# EAGLE schematic 006 (EAGLE 9.6.2)

## Sheet 1 of 2
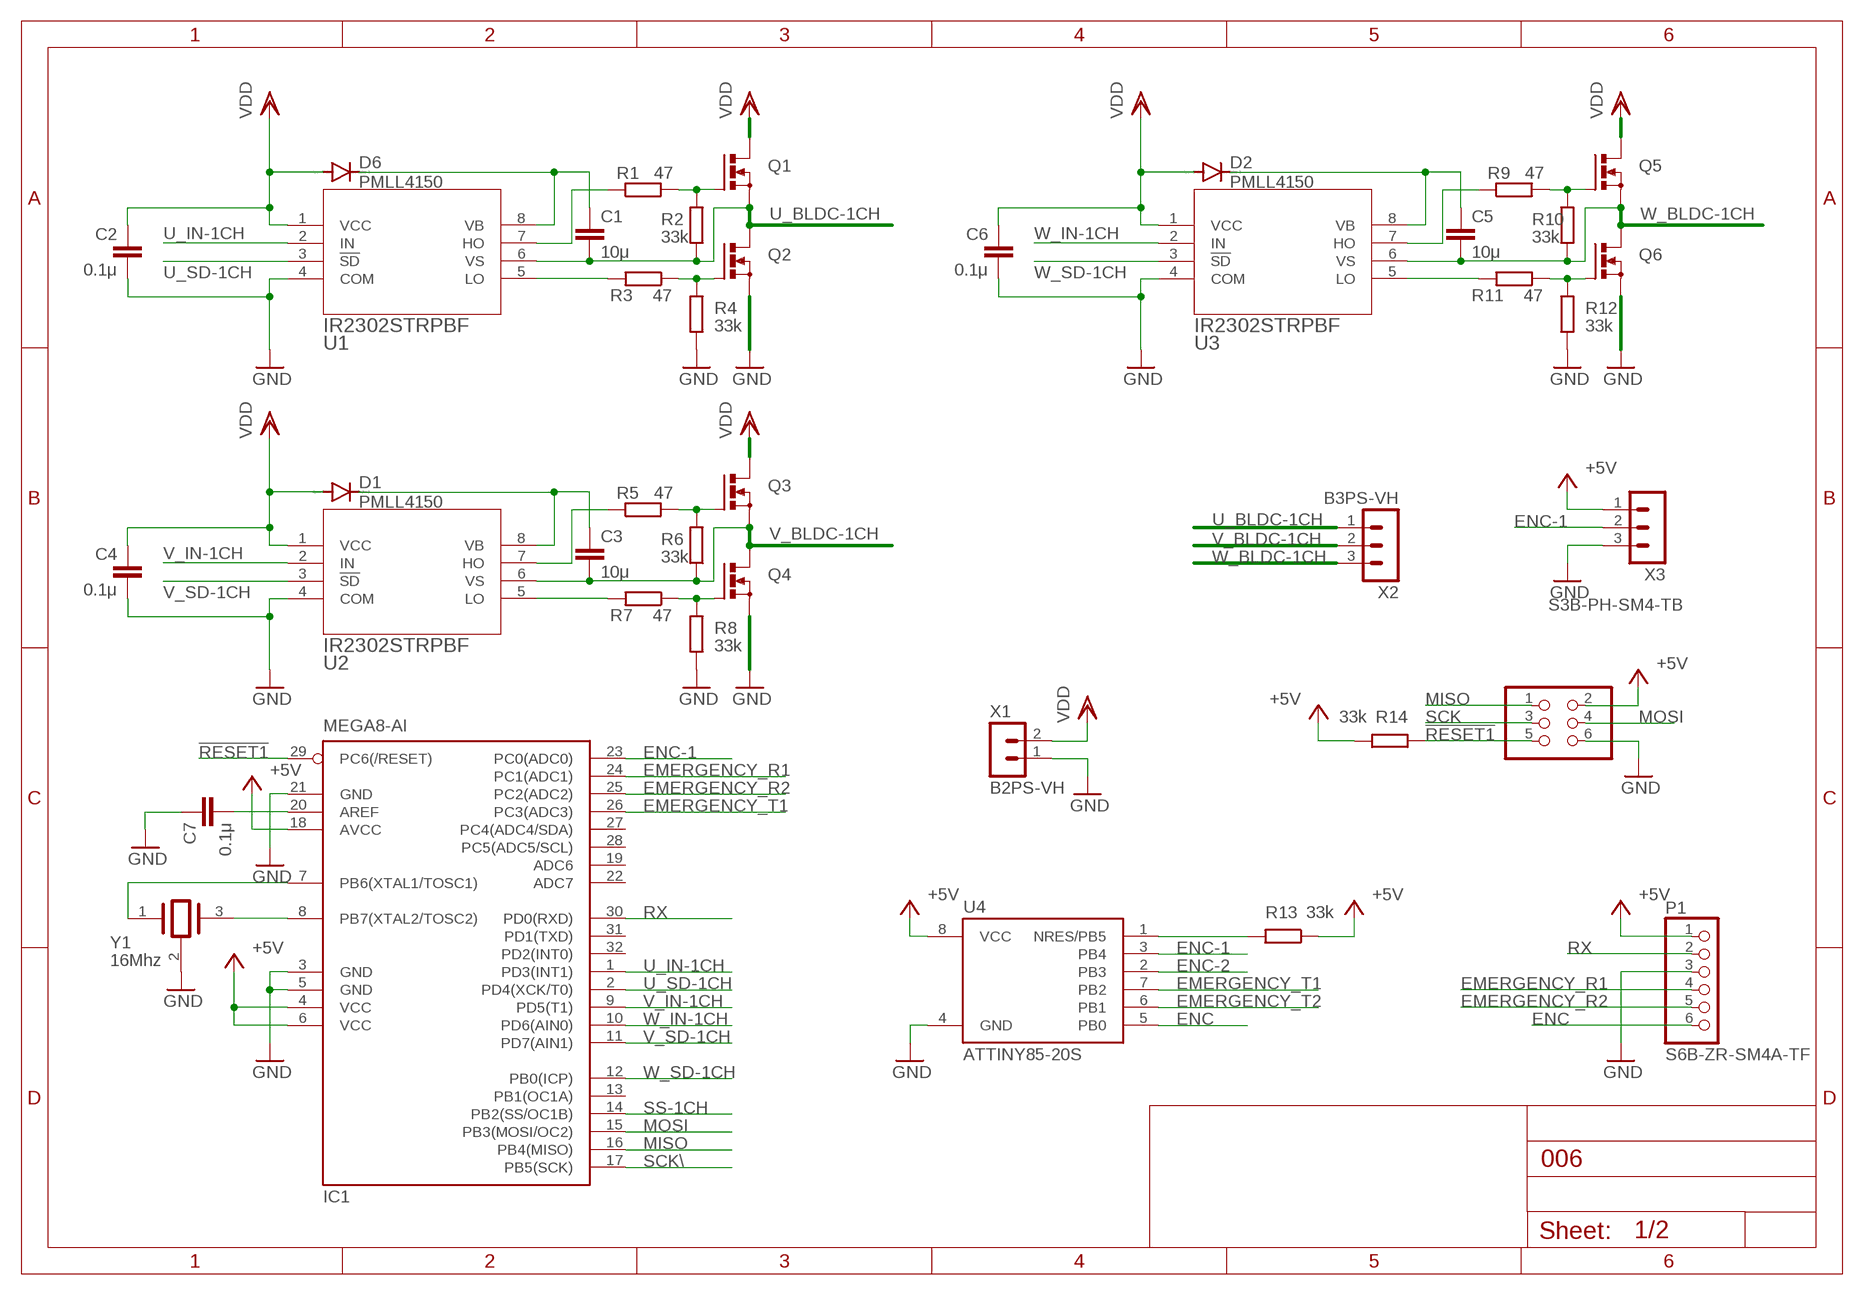
[diagram p0: schematic, sheet 1]

### Parts
C1  10μ  C-EUC1608  [C1608]
C2  0.1μ  C-EUC1608  [C1608]
C3  10μ  C-EUC1608  [C1608]
C4  0.1μ  C-EUC1608  [C1608]
C5  10μ  C-EUC1608  [C1608]
C6  0.1μ  C-EUC1608  [C1608]
C7  0.1μ  C-EUC1608  [C1608]
D1  PMLL4150  [SOD80C]
D2  PMLL4150  [SOD80C]
D6  PMLL4150  [SOD80C]
IC1  MEGA8-AI  [TQFP32-08]
JP1  PINHD-2X3  [2X03]
P1  S6B-ZR-SM4A-TF  [ZH-SM4-SIDE06]
Q1  N-MOSFET-SO8S  [SO-08]
Q2  N-MOSFET-SO8S  [SO-08]
Q3  N-MOSFET-SO8S  [SO-08]
Q4  N-MOSFET-SO8S  [SO-08]
Q5  N-MOSFET-SO8S  [SO-08]
Q6  N-MOSFET-SO8S  [SO-08]
R1  47  R-EU_R0603  [R0603]
R2  33k  R-EU_R0603  [R0603]
R3  47  R-EU_R0603  [R0603]
R4  33k  R-EU_R0603  [R0603]
R5  47  R-EU_R0603  [R0603]
R6  33k  R-EU_R0603  [R0603]
R7  47  R-EU_R0603  [R0603]
R8  33k  R-EU_R0603  [R0603]
R9  47  R-EU_R0603  [R0603]
R10  33k  R-EU_R0603  [R0603]
R11  47  R-EU_R0603  [R0603]
R12  33k  R-EU_R0603  [R0603]
R13  33k  R-EU_R0603  [R0603]
R14  33k  R-EU_R0603  [R0603]
U1  IR2302STRPBF  [PG-DSO-8-910_INF]
U2  IR2302STRPBF  [PG-DSO-8-910_INF]
U3  IR2302STRPBF  [PG-DSO-8-910_INF]
U4  ATTINY85-20S  [SOIC8_EIAJ_208MIL]
X1  B2PS-VH  [B2PS-VH]
X2  B3PS-VH  [B3PS-VH]
X3  S3B-PH-SM4-TB  [S3B-PH-SM4-TB]
Y1  16Mhz  MURATA_CSTNE16M0V53C000R0MURATA_CSTNE16M0V53C000R0_0_0  [MURATA_CSTNE16M0V53C000R0_0]

### Nets
!RESET1: IC1.29(PC6(/RESET)) JP1.5 R14.2
+5V: IC1.4(VCC) IC1.6(VCC) IC1.18(AVCC) JP1.2 P1.1 R13.1 R14.1 U4.8(VCC) X3.1 ; also sheet 2
EMERGENCY_R1: IC1.24(PC1(ADC1)) P1.4 ; also sheet 2
EMERGENCY_R2: IC1.25(PC2(ADC2)) P1.5 ; also sheet 2
EMERGENCY_T1: IC1.26(PC3(ADC3)) U4.7(PB2)
EMERGENCY_T2: U4.6(PB1) ; also sheet 2
ENC: P1.6 U4.5(PB0)
ENC-1: IC1.23(PC0(ADC0)) U4.3(PB4) X3.2
ENC-2: U4.2(PB3) ; also sheet 2
GND: C2.1 C4.1 C6.1 C7.2 IC1.3(GND) IC1.5(GND) IC1.21(GND) JP1.6 P1.3 Q2.1(S) Q2.2(S) Q2.3(S) Q4.1(S) Q4.2(S) Q4.3(S) Q6.1(S) Q6.2(S) Q6.3(S) R4.1 R8.1 R12.1 U1.4(COM) U2.4(COM) U3.4(COM) U4.4(GND) X1.1 X3.3 Y1.2(GND) ; also sheet 2
MISO: IC1.16(PB4(MISO)) JP1.1 ; also sheet 2
MOSI: IC1.15(PB3(MOSI/OC2)) JP1.4 ; also sheet 2
N$1: C3.1 D1.C U2.8(VB)
N$2: C1.1 D6.C U1.8(VB)
N$3: R1.1 U1.7(HO)
N$4: R5.1 U2.7(HO)
N$5: Q1.4(G) R1.2 R2.2
N$6: Q2.4(G) R3.1 R4.2
N$7: R3.2 U1.5(LO)
N$8: Q3.4(G) R5.2 R6.2
N$9: Q4.4(G) R7.1 R8.2
N$10: R7.2 U2.5(LO)
N$11: C5.1 D2.C U3.8(VB)
N$12: R9.1 U3.7(HO)
N$13: Q5.4(G) R9.2 R10.2
N$14: Q6.4(G) R11.1 R12.2
N$15: R11.2 U3.5(LO)
N$16: R13.2 U4.1(NRES/PB5)
N$20: IC1.8(PB7(XTAL2/TOSC2)) Y1.3(OUTPUT)
N$21: IC1.7(PB6(XTAL1/TOSC1)) Y1.1(INPUT)
N$23: C7.1 IC1.20(AREF)
RX: IC1.30(PD0(RXD)) P1.2 ; also sheet 2
SCK: JP1.3 ; also sheet 2
SCK\: IC1.17(PB5(SCK)) ; also sheet 2
SS-1CH: IC1.14(PB2(SS/OC1B))
U_BLDC-1CH: C1.2 Q1.1(S) Q1.2(S) Q1.3(S) Q2.5(D) Q2.6(D) Q2.7(D) Q2.8(D) R2.1 U1.6(VS) X2.1
U_IN-1CH: IC1.1(PD3(INT1)) U1.2(IN)
U_SD-1CH: IC1.2(PD4(XCK/T0)) U1.3(!SD)
V_BLDC-1CH: C3.2 Q3.1(S) Q3.2(S) Q3.3(S) Q4.5(D) Q4.6(D) Q4.7(D) Q4.8(D) R6.1 U2.6(VS) X2.2
V_IN-1CH: IC1.9(PD5(T1)) U2.2(IN)
V_SD-1CH: IC1.11(PD7(AIN1)) U2.3(!SD)
VDD: C2.2 C4.2 C6.2 D1.A D2.A D6.A Q1.5(D) Q1.6(D) Q1.7(D) Q1.8(D) Q3.5(D) Q3.6(D) Q3.7(D) Q3.8(D) Q5.5(D) Q5.6(D) Q5.7(D) Q5.8(D) U1.1(VCC) U2.1(VCC) U3.1(VCC) X1.2 ; also sheet 2
W_BLDC-1CH: C5.2 Q5.1(S) Q5.2(S) Q5.3(S) Q6.5(D) Q6.6(D) Q6.7(D) Q6.8(D) R10.1 U3.6(VS) X2.3
W_IN-1CH: IC1.10(PD6(AIN0)) U3.2(IN)
W_SD-1CH: IC1.12(PB0(ICP)) U3.3(!SD)
Unconnected: IC1.13(PB1(OC1A)) IC1.19(ADC6) IC1.22(ADC7) IC1.27(PC4(ADC4/SDA)) IC1.28(PC5(ADC5/SCL)) IC1.31(PD1(TXD)) IC1.32(PD2(INT0))

## Sheet 2 of 2
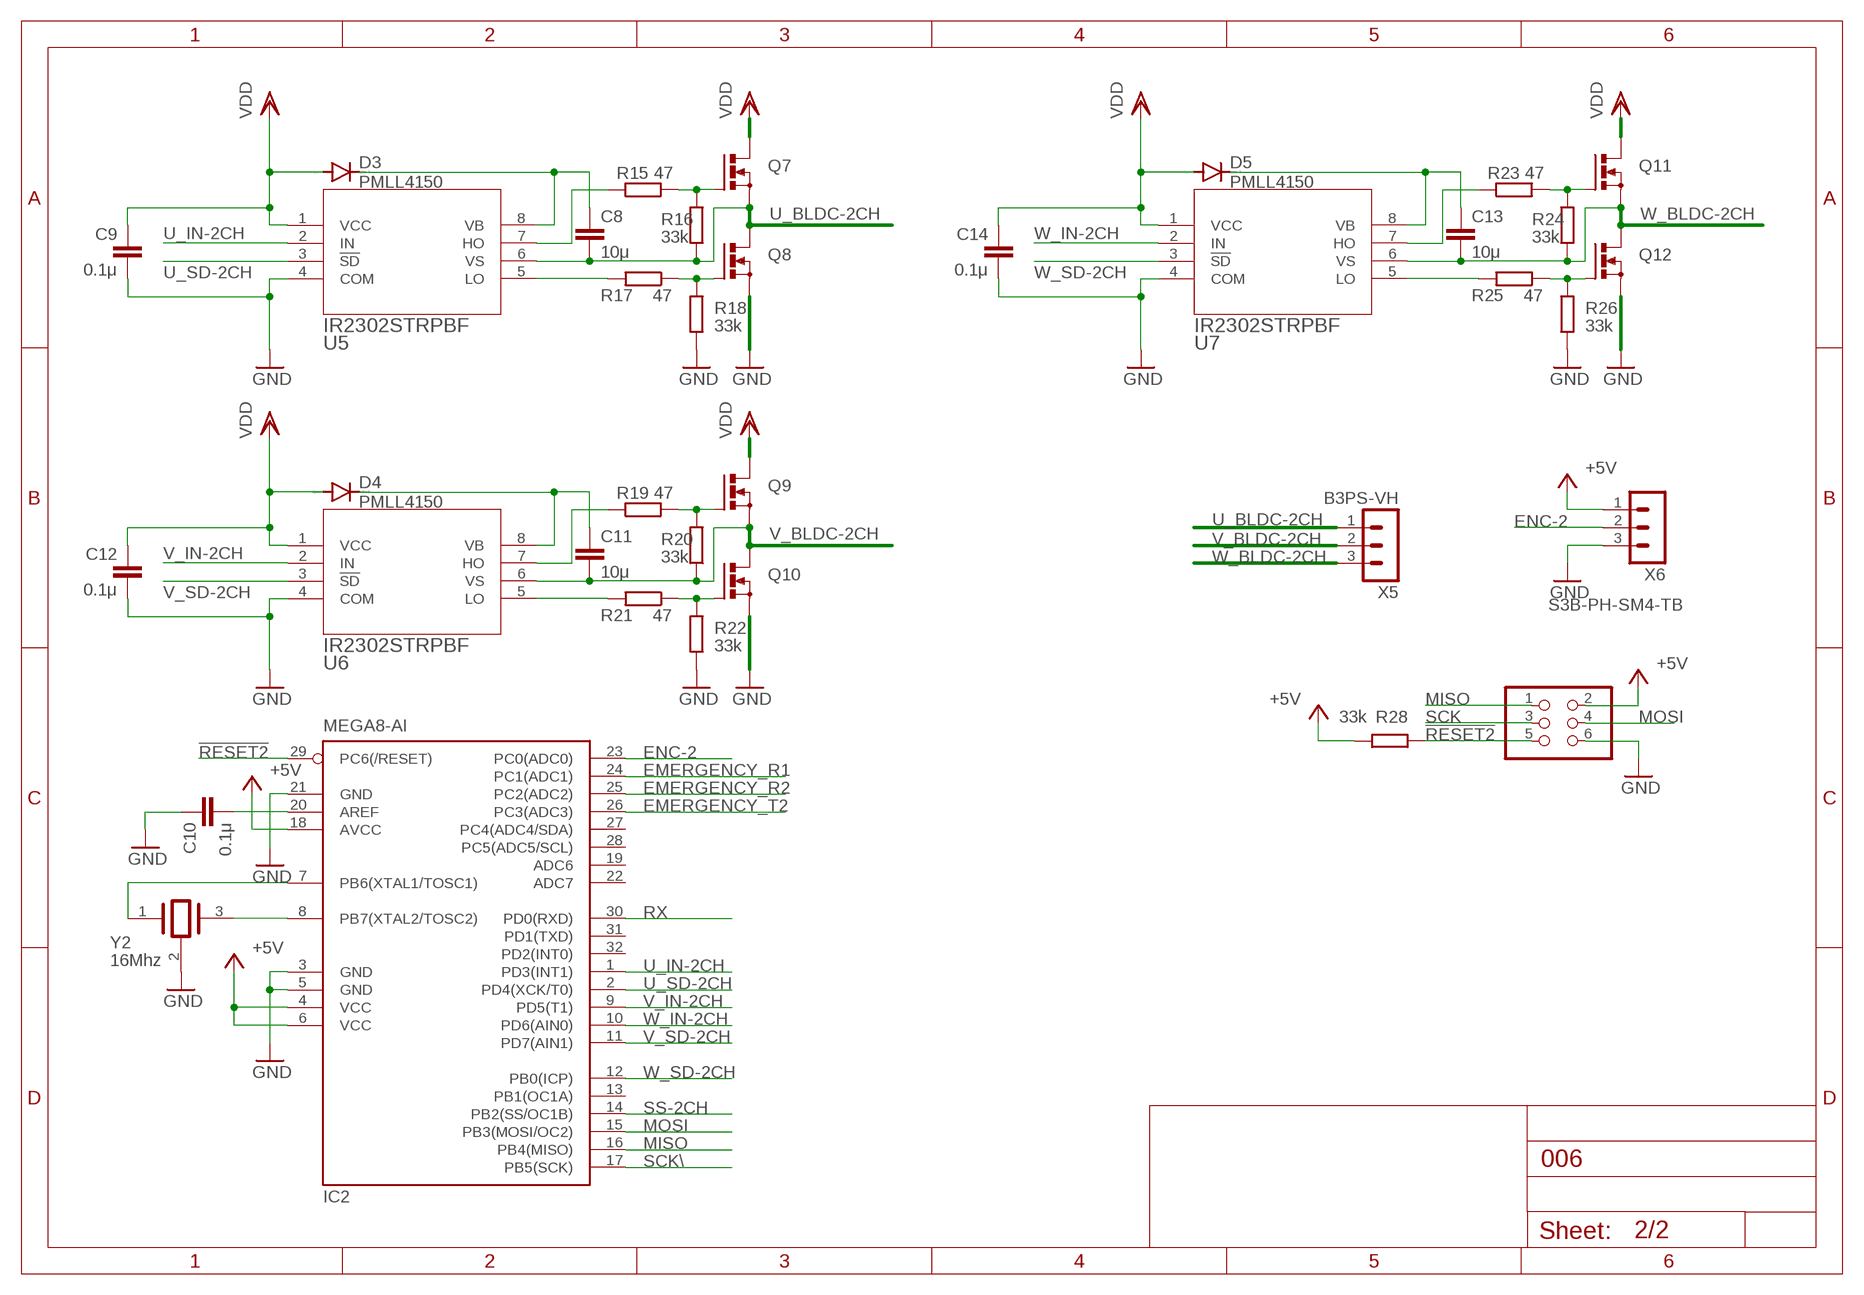
[diagram p1: schematic, sheet 2]

### Parts
C8  10μ  C-EUC1608  [C1608]
C9  0.1μ  C-EUC1608  [C1608]
C10  0.1μ  C-EUC1608  [C1608]
C11  10μ  C-EUC1608  [C1608]
C12  0.1μ  C-EUC1608  [C1608]
C13  10μ  C-EUC1608  [C1608]
C14  0.1μ  C-EUC1608  [C1608]
D3  PMLL4150  [SOD80C]
D4  PMLL4150  [SOD80C]
D5  PMLL4150  [SOD80C]
IC2  MEGA8-AI  [TQFP32-08]
JP2  PINHD-2X3  [2X03]
Q7  N-MOSFET-SO8S  [SO-08]
Q8  N-MOSFET-SO8S  [SO-08]
Q9  N-MOSFET-SO8S  [SO-08]
Q10  N-MOSFET-SO8S  [SO-08]
Q11  N-MOSFET-SO8S  [SO-08]
Q12  N-MOSFET-SO8S  [SO-08]
R15  47  R-EU_R0603  [R0603]
R16  33k  R-EU_R0603  [R0603]
R17  47  R-EU_R0603  [R0603]
R18  33k  R-EU_R0603  [R0603]
R19  47  R-EU_R0603  [R0603]
R20  33k  R-EU_R0603  [R0603]
R21  47  R-EU_R0603  [R0603]
R22  33k  R-EU_R0603  [R0603]
R23  47  R-EU_R0603  [R0603]
R24  33k  R-EU_R0603  [R0603]
R25  47  R-EU_R0603  [R0603]
R26  33k  R-EU_R0603  [R0603]
R28  33k  R-EU_R0603  [R0603]
U5  IR2302STRPBF  [PG-DSO-8-910_INF]
U6  IR2302STRPBF  [PG-DSO-8-910_INF]
U7  IR2302STRPBF  [PG-DSO-8-910_INF]
X5  B3PS-VH  [B3PS-VH]
X6  S3B-PH-SM4-TB  [S3B-PH-SM4-TB]
Y2  16Mhz  MURATA_CSTNE16M0V53C000R0MURATA_CSTNE16M0V53C000R0_0_0  [MURATA_CSTNE16M0V53C000R0_0]

### Nets
!RESET2: IC2.29(PC6(/RESET)) JP2.5 R28.2
+5V: IC2.4(VCC) IC2.6(VCC) IC2.18(AVCC) JP2.2 R28.1 X6.1 ; also sheet 1
EMERGENCY_R1: IC2.24(PC1(ADC1)) ; also sheet 1
EMERGENCY_R2: IC2.25(PC2(ADC2)) ; also sheet 1
EMERGENCY_T2: IC2.26(PC3(ADC3)) ; also sheet 1
ENC-2: IC2.23(PC0(ADC0)) X6.2 ; also sheet 1
GND: C9.1 C10.2 C12.1 C14.1 IC2.3(GND) IC2.5(GND) IC2.21(GND) JP2.6 Q8.1(S) Q8.2(S) Q8.3(S) Q10.1(S) Q10.2(S) Q10.3(S) Q12.1(S) Q12.2(S) Q12.3(S) R18.1 R22.1 R26.1 U5.4(COM) U6.4(COM) U7.4(COM) X6.3 Y2.2(GND) ; also sheet 1
MISO: IC2.16(PB4(MISO)) JP2.1 ; also sheet 1
MOSI: IC2.15(PB3(MOSI/OC2)) JP2.4 ; also sheet 1
N$17: C8.1 D3.C U5.8(VB)
N$18: R15.1 U5.7(HO)
N$19: Q7.4(G) R15.2 R16.2
N$22: Q8.4(G) R17.1 R18.2
N$24: R17.2 U5.5(LO)
N$25: IC2.8(PB7(XTAL2/TOSC2)) Y2.3(OUTPUT)
N$26: IC2.7(PB6(XTAL1/TOSC1)) Y2.1(INPUT)
N$27: C10.1 IC2.20(AREF)
N$28: C11.1 D4.C U6.8(VB)
N$29: R19.1 U6.7(HO)
N$30: Q9.4(G) R19.2 R20.2
N$31: Q10.4(G) R21.1 R22.2
N$32: R21.2 U6.5(LO)
N$33: C13.1 D5.C U7.8(VB)
N$34: R23.1 U7.7(HO)
N$35: Q11.4(G) R23.2 R24.2
N$36: Q12.4(G) R25.1 R26.2
N$37: R25.2 U7.5(LO)
RX: IC2.30(PD0(RXD)) ; also sheet 1
SCK: JP2.3 ; also sheet 1
SCK\: IC2.17(PB5(SCK)) ; also sheet 1
SS-2CH: IC2.14(PB2(SS/OC1B))
U_BLDC-2CH: C8.2 Q7.1(S) Q7.2(S) Q7.3(S) Q8.5(D) Q8.6(D) Q8.7(D) Q8.8(D) R16.1 U5.6(VS) X5.1
U_IN-2CH: IC2.1(PD3(INT1)) U5.2(IN)
U_SD-2CH: IC2.2(PD4(XCK/T0)) U5.3(!SD)
V_BLDC-2CH: C11.2 Q9.1(S) Q9.2(S) Q9.3(S) Q10.5(D) Q10.6(D) Q10.7(D) Q10.8(D) R20.1 U6.6(VS) X5.2
V_IN-2CH: IC2.9(PD5(T1)) U6.2(IN)
V_SD-2CH: IC2.11(PD7(AIN1)) U6.3(!SD)
VDD: C9.2 C12.2 C14.2 D3.A D4.A D5.A Q7.5(D) Q7.6(D) Q7.7(D) Q7.8(D) Q9.5(D) Q9.6(D) Q9.7(D) Q9.8(D) Q11.5(D) Q11.6(D) Q11.7(D) Q11.8(D) U5.1(VCC) U6.1(VCC) U7.1(VCC) ; also sheet 1
W_BLDC-2CH: C13.2 Q11.1(S) Q11.2(S) Q11.3(S) Q12.5(D) Q12.6(D) Q12.7(D) Q12.8(D) R24.1 U7.6(VS) X5.3
W_IN-2CH: IC2.10(PD6(AIN0)) U7.2(IN)
W_SD-2CH: IC2.12(PB0(ICP)) U7.3(!SD)
Unconnected: IC2.13(PB1(OC1A)) IC2.19(ADC6) IC2.22(ADC7) IC2.27(PC4(ADC4/SDA)) IC2.28(PC5(ADC5/SCL)) IC2.31(PD1(TXD)) IC2.32(PD2(INT0))

## Library data of the parts
C1-C14 = rcl:C-EU: CAPACITOR, European symbol; SPICEPREFIX: C
D1-D6 = diode:PMLL4150: DIODE high speed
IC1 IC2 = atmel:MEGA8: MICROCONTROLLER 8 Kbytes FLASH, 1 kbytes SRAM, 512 bytes EEPROM, USART, 6-channel 10 bit ADC, 2-channel 8 bit ADC Pin compatible with Atmega48, ATMega88, ATMega168 Source: avr.lbr; MPN: ATMEGA8-16AU; OC_FARNELL: 9171371; OC_NEWARK: 73M8863
JP1 JP2 = pinhead:PINHD-2X3: PIN HEADER
P1 = zh:S6B-ZR-SM4A-TF
Q1-Q12 = transistor-power:N-MOSFET-SO8: N-Channel MOSFET Example: FDS7760A; N-Channel Logic Level PowerTrench® MOSFET FDS2572; N-Channel UltraFET® Trench MOSFET Source: www.fairchildsemi.com
R1-R26 R28 = rcl:R-EU_: RESISTOR, European symbol; SPICEPREFIX: R
U1-U3 U5-U7 = IR2302:IR2302STRPBF; BUILT_BY: EMA_Cory; COPYRIGHT: Copyright (C) 2018 Accelerated Designs. All rights reserved; DATASHEET: https://www.infineon.com/dgdl/Infineon-IR2302-DataSheet-v01_00-EN.pdf?fileId=5546d462533600a4015355c988b216de; MANUFACTURER_PART_NUMBER: IR2302STRPBF; SOURCELIBRARY: Add_to_database_2021-04-22; VENDOR: Infineon
U4 = _hhn_attiny25_45_85:ATTINY85*: ATMEL ATtiny 85 Packages: P = PDIP 08 30mil S = SOIC 08 EIAJ 208mil Technologies Note: for complete ordering code (temp. range, finish, tape&reel etc.) see www.atmel.com • Supply Voltage: V = (1.8…5.5)V | [blank] = (2.7…5.5)V • Speed: 10 = 10 MHz | 20 = 20 MHz Author: Dipl.-Ing. FH Rainer Bayer HHN Hochschule Heilbronn (Heilbronn University), rainer.bayer@hs-heilbronn.de Ingenieurbüro ing-rb, mail@ing-rb.de
X1 = con-JST VH:B2PS-VH: JST VH Series header 3.96mm pitch disconnectable crimp style connectors, horizontal (side entry type), 2 pins
X2 X5 = con-JST VH:B3PS-VH: JST VH Series header 3.96mm pitch disconnectable crimp style connectors, horizontal (side entry type), 3 pins
X3 X6 = con-JST PH:S3B-PH: JST PH series header 2.00mm pitch disconnectable crimp style connectors, horizontal (side entry type), 3 pins
Y1 Y2 = Murata - CSTNE16M0V53C000R0:MURATA_CSTNE16M0V53C000R0: 16MHz Ceramic Resonator Built in Capacitor 15pF ±0.15% 40 Ohms -40°C ~ 125°C Surface Mount; AUTOMOTIVE: Yes; AUTOMOTIVE_GRADE: Grade 1; CENTROID_NOT_SPECIFIED: No; DATASHEET: https://www.murata.com/ja-jp/products/productdetail.aspx?partno=CSTNE16M0V53C000R0; DEVICE_CLASS_L1: Passive Components; DEVICE_CLASS_L2: Crystals / Oscillators; DEVICE_CLASS_L3: Resonators; DIGIKEY_DESCRIPTION: CERAMIC RES 16.0000MHZ 15PF SMD; DIGIKEY_PART_NUMBER: 490-17949-1-ND; FOOTPRINT_VARIANT_NAME_0: Recommended_Land_Pattern; FREQUENCY: 16MHz; HEIGHT: 1mm; LEAD_FREE: Yes; LOAD_CAPACITANCE: 15pF; MF: Murata; MFG_PACKAGE_IDENT: 0; MFG_PACKAGE_IDENT_DATE: 0; MFG_PACKAGE_IDENT_REV: 0; MOUSER_DESCRIPTION: Ceramic Resonator 16MHz ±0.5% (Tol) ±0.15% (Stability) 15pF 40Ohm Automotive 3-Pin CSMD T/R; MOUSER_PART_NUMBER: 81-CSTNE16M0V53C000R; MPN: CSTNE16M0V53C000R0; PACKAGE: SMD; PREFIX: Y; ROHS: Yes; SERIES: CSTNE_V_C; STABILITY: 0.15%; TEMPERATURE_RANGE_HIGH: +125°C; TEMPERATURE_RANGE_LOW: -40°C; TOLERANCE: 0.5%; VERIFICATION_VERSION: 0.0.0.3